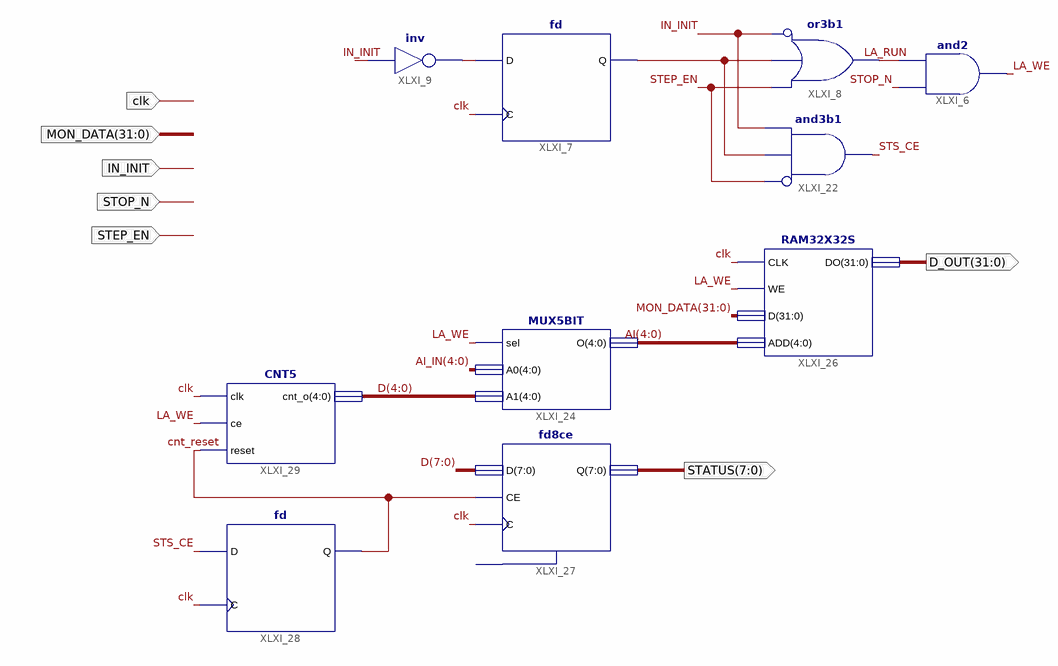
[diagram p0: schematic sheet 1]
// Xilinx ISE schematic LogicAnalyzer.sch (spartan6) as structural Verilog: 10 symbols, 8 ports
module LogicAnalyzer (
  input  [31:0] MON_DATA,
  input  clk,
  input  IN_INIT,
  input  STEP_EN,
  input  STOP_N,
  input  [4:0] AI_IN,
  output [31:0] D_OUT,
  output [7:0] STATUS
);

  wire cnt_reset, LA_RUN, LA_WE, STS_CE, XLXN_29, XLXN_54;
  wire [4:0] AI;
  wire [7:0] D;

  and XLXI_6 (LA_WE, STOP_N, LA_RUN);
  or XLXI_8 (LA_RUN, ~IN_INIT, XLXN_54, STEP_EN);  // or3b1
  fd XLXI_7 (.C(clk), .D(XLXN_29), .Q(XLXN_54));
  not XLXI_9 (XLXN_29, IN_INIT);
  and XLXI_22 (STS_CE, ~STEP_EN, XLXN_54, IN_INIT);  // and3b1
  MUX5BIT XLXI_24 (.sel(LA_WE), .A0(AI_IN), .A1(D[4:0]), .O(AI));
  RAM32X32S XLXI_26 (.CLK(clk), .WE(LA_WE), .D(MON_DATA), .ADD(AI), .DO(D_OUT));
  fd8ce XLXI_27 (.C(clk), .CE(cnt_reset), .D(D), .Q(STATUS));  // open: CLR
  fd XLXI_28 (.C(clk), .D(STS_CE), .Q(cnt_reset));
  CNT5 XLXI_29 (.clk(clk), .ce(LA_WE), .reset(cnt_reset), .cnt_o(D[4:0]));
endmodule
